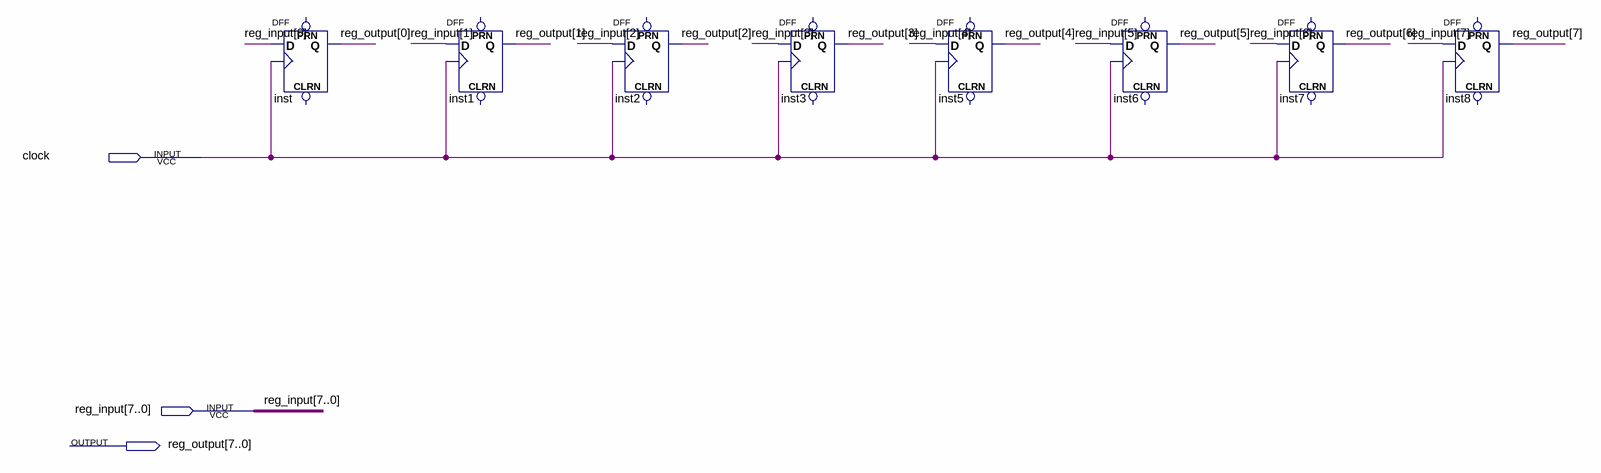
[diagram p0: schematic sheet]
// Quartus schematic register_8bit.bdf as structural Verilog: 8 symbols, 3 pins
module register_8bit (
  input  clock,
  input  [7:0] reg_input,
  output [7:0] reg_output
);

  DFF inst (.CLK(clock), .D(reg_input[0]), .Q(reg_output[0]));  // open: CLRN, PRN
  DFF inst1 (.CLK(clock), .D(reg_input[1]), .Q(reg_output[1]));  // open: CLRN, PRN
  DFF inst2 (.CLK(clock), .D(reg_input[2]), .Q(reg_output[2]));  // open: CLRN, PRN
  DFF inst3 (.CLK(clock), .D(reg_input[3]), .Q(reg_output[3]));  // open: CLRN, PRN
  DFF inst5 (.CLK(clock), .D(reg_input[4]), .Q(reg_output[4]));  // open: CLRN, PRN
  DFF inst6 (.CLK(clock), .D(reg_input[5]), .Q(reg_output[5]));  // open: CLRN, PRN
  DFF inst7 (.CLK(clock), .D(reg_input[6]), .Q(reg_output[6]));  // open: CLRN, PRN
  DFF inst8 (.CLK(clock), .D(reg_input[7]), .Q(reg_output[7]));  // open: CLRN, PRN
endmodule
